# Altium schematic sheet VrefSch.SchDoc
size A
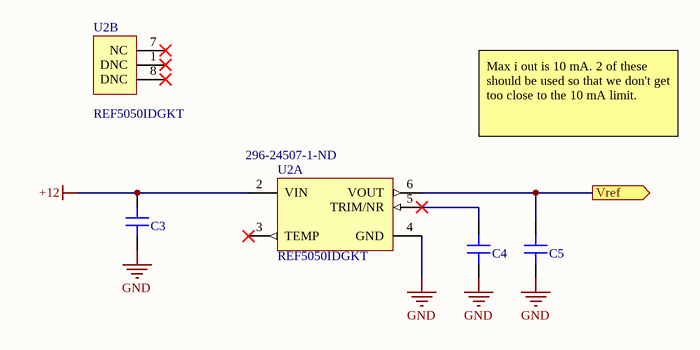
[diagram p0: VrefSch.SchDoc]

## Parts
C3  1uF  [CAP 0805/2012]  (value not drawn)
C4  1uF  [CAP 0805/2012]  (value not drawn)
C5  1uF  [CAP 0805/2012]  (value not drawn)
U2  REF5050IDGKT  Supplier Part Number 1: 296-24507-1-ND  [DGK0008A_N]  (parts A,B of 2)

## Ports
Vref (out)

## Nets
+12: C3.2 U2.2(VIN)
GND: C3.1 C4.1 C5.1 U2.4(GND)
Vref: C5.2 U2.6(VOUT) ; port Vref
NetC4_2: C4.2 U2.5(TRIM/NR)

Not connected (* = marked no-connect by the designer): U2 1(DNC)* 3(TEMP)* 7(NC)* 8(DNC)*

## Notes on the sheet
- Max i out is 10 mA. 2 of these should be used so that we don't get too close to the 10 mA limit.

## Library data of the parts
C3-C5 = C0805C105J3RACTU: CAP CER 1UF 25V X7R 0805; Manufacturer: Kemet; TemperatureRange: -55C ~ 125C; Tolerance: 5%; Value: 1uF; Part Number: C0805C105J3RACTU; PartId: 6145; Supplier 1: Digi-Key; Supplier Part Number 1: 399-10060-2-ND; ComponentLink1Description: Datasheet; ComponentLink1URL: http://www.kemet.com/docfinder?Partnumber=C0805C105J3RACTU; ComponentLink2Description: Digi-Key listing; ComponentLink2URL: http://digikey.com/product-detail/en/C0805C105J3RACTU/399-10060-2-ND/2211758; TemperatureCoefficient: X7R; Voltage: 25V; Price: 0.355; Type: -; Device Package: 0805 (2012 Metric)
U2 = CMP-0367-00254-2: Low Noise, Very Low Drift, Precision Voltage Reference, -40 to 125 degC, 8-pin VSSOP (DGK), Green (RoHS & no Sb/Br); Manufacturer: Texas Instruments; VI(Min)(V): 5.2; Rating: Catalog; Initial Accuracy @ 25/deg C(%): 0.05; VO(V): 5; Iq(Max)(uA): 1000; SubFamily: Series Voltage Reference; Temp Coeff(Max)(ppm/ degree C): 3; Iout/Iz(Max)(mA): 10; VI(Max)(V): 18; ComponentLink1Description: Manufacturer URL; PartNumber: REF5050IDGKT; PackageVersion: 4073329/E; Code_JEDEC: MO-187; Eco-Plan: Green (RoHS & no Sb/Br); ComponentLink2Description: Datasheet; PackageReference: DGK0008A; ComponentLink2URL: http://www.ti.com/general/docs/lit/getliterature.tsp?genericPartNumber=REF5050&fileType=pdf; ComponentLink3URL: http://www.ti.com/litv/pdf/mpds028d; ComponentLink1URL: http://www.ti.com/; PackageDescription: 8-Pin Thin Small Outline Package 3 x 3 mm Body ,0.65 mm Pitch; ComponentLink3Description: Package Specification; Mounting Technology: Surface Mount; DatasheetVersion: SBOS410E; Supplier 1: Digi-Key